# Altium schematic sheet ifamp-tx.SchDoc: TX IF Amplifier
size Letter; CheckedBy: J. Brinton; CompanyName: Signal Laboratories, Inc.; DrawnBy: J. Brinton; Engineer: J. Brinton; Address1: 3479 Edison Way; Address2: Menlo Park CA 94025; Address3: +1 (877) 778-8435; Address4: siglabs.com; Revision: 3; SheetNumber: 5; SheetTotal: 49
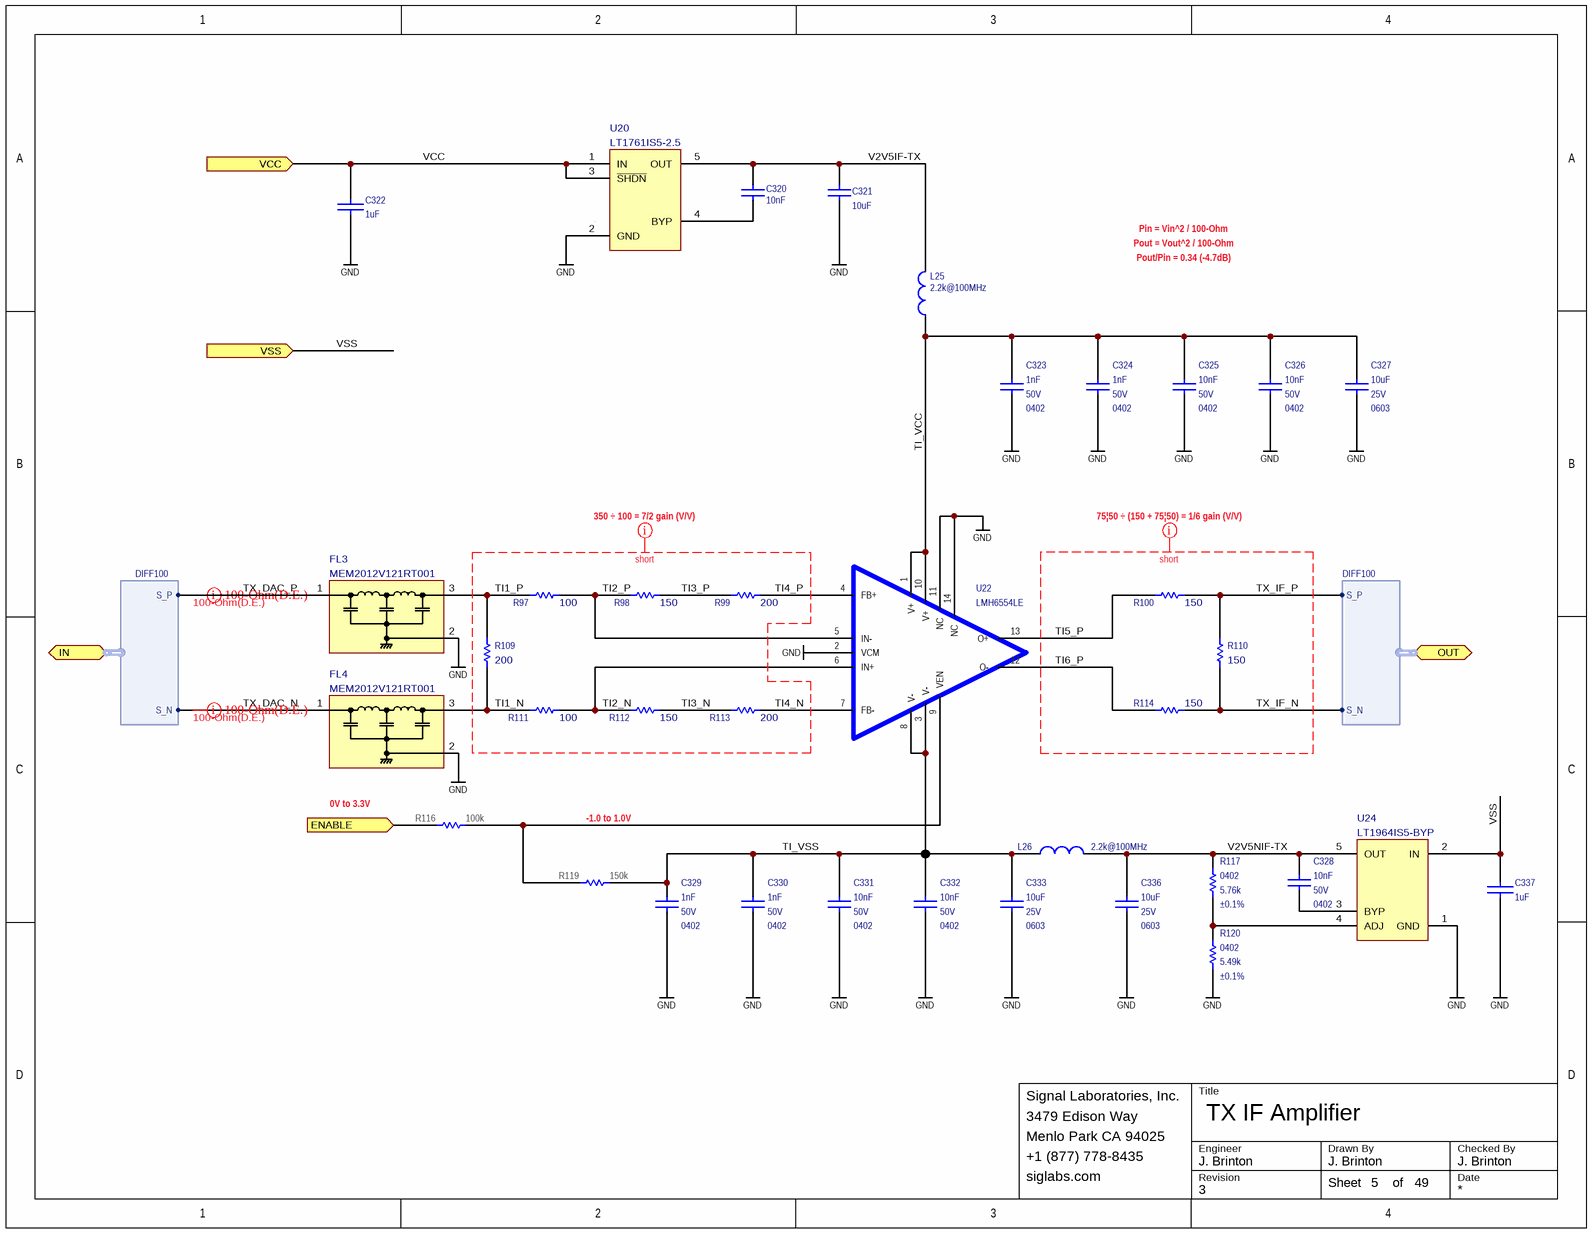
[diagram p0: ifamp-tx.SchDoc]

## Parts
C320  value 10nF  [CAPC100X50X55L25N]  (hidden comment: GRM155R71H103KA88)
C321  value 10uF  [CAPC160X80X90L20N]  (hidden comment: ZRB18AR61E106ME01L)
C322  value 1uF  [CAPC100X50X55L25N]  (hidden comment: GRM155R61A105KE15)
C323  value 1nF  Voltage: 50V  Package: 0402  [CAPC100X50X55L25N]  (hidden comment: CGA2B2NP01H102J050BA)
C324  value 1nF  Voltage: 50V  Package: 0402  [CAPC100X50X55L25N]  (hidden comment: CGA2B2NP01H102J050BA)
C325  value 10nF  Voltage: 50V  Package: 0402  [CAPC100X50X55L25N]  (hidden comment: GRM155R71H103KA88)
C326  value 10nF  Voltage: 50V  Package: 0402  [CAPC100X50X55L25N]  (hidden comment: GRM155R71H103KA88)
C327  value 10uF  Voltage: 25V  Package: 0603  [CAPC160X80X90L20N]  (hidden comment: ZRB18AR61E106ME01L)
C328  value 10nF  Voltage: 50V  Package: 0402  [CAPC100X50X55L25N]  (hidden comment: GRM155R71H103KA88)
C329  value 1nF  Voltage: 50V  Package: 0402  [CAPC100X50X55L25N]  (hidden comment: CGA2B2NP01H102J050BA)
C330  value 1nF  Voltage: 50V  Package: 0402  [CAPC100X50X55L25N]  (hidden comment: CGA2B2NP01H102J050BA)
C331  value 10nF  Voltage: 50V  Package: 0402  [CAPC100X50X55L25N]  (hidden comment: GRM155R71H103KA88)
C332  value 10nF  Voltage: 50V  Package: 0402  [CAPC100X50X55L25N]  (hidden comment: GRM155R71H103KA88)
C333  value 10uF  Voltage: 25V  Package: 0603  [CAPC160X80X90L20N]  (hidden comment: ZRB18AR61E106ME01L)
C336  value 10uF  Voltage: 25V  Package: 0603  [CAPC160X80X90L20N]  (hidden comment: ZRB18AR61E106ME01L)
C337  value 1uF  [CAPC100X50X55L25N]  (hidden comment: GRM155R61A105KE15)
FL3  MEM2012V121RT001  [MEM2012V]
FL4  MEM2012V121RT001  [MEM2012V]
L25  value 2.2k@100MHz  [INDC1005X55N]  (hidden comment: MMZ1005A222ET000)
L26  value 2.2k@100MHz  [INDC1005X55N]  (hidden comment: MMZ1005A222ET000)
R97  value 100  [RESC1608X55N]  (hidden comment: MCT0603MD1000DP500)
R98  value 150  [RESC1608X55N]  (hidden comment: MCT0603MD1500DP500)
R99  value 200  [RESC1608X55N]  (hidden comment: MCT06030C2000FP500)
R100  value 150  [RESC1608X55N]  (hidden comment: MCT0603MD1500DP500)
R109  value 200  [RESC1608X55N]  (hidden comment: MCT06030C2000FP500)
R110  value 150  [RESC1608X55N]  (hidden comment: MCT0603MD1500DP500)
R111  value 100  [RESC1608X55N]  (hidden comment: MCT0603MD1000DP500)
R112  value 150  [RESC1608X55N]  (hidden comment: MCT0603MD1500DP500)
R113  value 200  [RESC1608X55N]  (hidden comment: MCT06030C2000FP500)
R114  value 150  [RESC1608X55N]  (hidden comment: MCT0603MD1500DP500)
R116  value 100k  [RESC1005X40N]  (hidden comment: ERJ-2RKF1003X)
R117  value 5.76k  Tolerance: ±0.1%  Package: 0402  [RESC1005X40N]  (hidden comment: RT0402BRE075K76L)
R119  value 150k  [RESC1005X40N]  (hidden comment: ERJ-2RKF1503X)
R120  value 5.49k  Tolerance: ±0.1%  Package: 0402  [RESC1005X40N]  (hidden comment: ERA-2AEB5491X)
U20  LT1761IS5-2.5  [TSOT-5]
U22  LMH6554LE  [NHJ0014A]
U24  LT1964IS5-BYP  [SOT23-5]

## Ports
ENABLE (in), IN (harness DIFF100), OUT (harness DIFF100), VCC (in), VSS (in)

## Harnesses
DIFF100: S_P, S_N

## Nets
GND: C321.1 C322.1 C323.1 C324.1 C325.1 C326.1 C327.1 C329.1 C330.1 C331.1 C332.1 C333.1 C336.1 C337.1 FL3.2(GND) FL4.2(GND) R120.1 U20.2(GND) U22.2(VCM) U22.11(NC) U22.14(NC) U24.1(GND)
ENABLE: R116.2 ; port ENABLE
TI1_N: FL4.3(OUT/IN) R109.1 R111.1
TI1_P: FL3.3(OUT/IN) R97.1 R109.2
TI2_N: R111.2 R112.1 U22.6(IN+)
TI2_P: R97.2 R98.1 U22.5(IN-)
TI3_N: R112.2 R113.1
TI3_P: R98.2 R99.1
TI4_N: R113.2 U22.7(FB-)
TI4_P: R99.2 U22.4(FB+)
TI5_P: R100.1 U22.13(O+)
TI6_P: R114.1 U22.12(O-)
TI_VCC: C323.2 C324.2 C325.2 C326.2 C327.2 L25.1 U22.1(V+) U22.10(V+)
TI_VSS: C329.2 C330.2 C331.2 C332.2 C333.2 L26.1 R119.1 U22.3(V-) U22.8(V-)
TX_DAC_N: FL4.1(IN/OUT) ; port IN.S_N
TX_DAC_P: FL3.1(IN/OUT) ; port IN.S_P
TX_IF_N: R110.1 R114.2 ; port OUT.S_N
TX_IF_P: R100.2 R110.2 ; port OUT.S_P
V2V5IF-TX: C320.2 C321.2 L25.2 U20.5(OUT)
V2V5NIF-TX: C328.2 C336.2 L26.2 R117.2 U24.5(OUT)
VCC: C322.2 U20.1(IN) U20.3(~{SHDN}) ; port VCC
VSS: C337.2 U24.2(IN) ; port VSS
NetC320_1: C320.1 U20.4(BYP)
NetC328_1: C328.1 U24.3(BYP)
NetR116_1: R116.1 R119.2 U22.9(VEN)
NetR117_1: R117.1 R120.2 U24.4(ADJ)

## Layout directives
differential pair; net class z100diff12; Name: 100-Ohm(D.E.); net class rf: TX_DAC_N, TX_DAC_P
net class short: TI1_N, TI1_P, TI2_N, TI2_P, TI3_N, TI3_P, TI4_N, TI4_P, TI5_P, TI6_P, TX_IF_N, TX_IF_P

## Notes on the sheet
- Pin = Vin^2 / 100-Ohm
- Pout = Vout^2 / 100-Ohm
- Pout/Pin = 0.34 (-4.7dB)
- 350 ÷ 100 = 7/2 gain (V/V)
- 75|50 ÷ (150 + 75|50) = 1/6 gain (V/V)
- 0V to 3.3V
- -1.0 to 1.0V
- Title
- Engineer
- Revision
- Drawn By
- Checked By
- Date
- Sheet
- of

## Library data of the parts
C320 C325 C326 C328 C331 C332 = CAP 0402: Ceramic Capacitor 10nF ±10% 50V X7R 0402; Manufacturer: Murata; Tr: -55:125; Manufacturer P/N: GRM155R71H103KA88; Tolerance: ±10%
  C320: Voltage: 50V; Package: 0402
C321 C327 C333 C336 = CAP 0603: Ceramic Capacitor 10uF ±20% 25V X5R 0603; Manufacturer: Murata; Tr: -55:85; Manufacturer P/N: ZRB18AR61E106ME01L; Tolerance: ±20%
  C321: Voltage: 25V; Package: 0603
C322 C337 = CAP: Ceramic Capacitor 1uF ±10% 10V X5R 0402; Manufacturer: Murata; Tr: -55:125; Manufacturer P/N: GRM155R61A105KE15; Package: 0402; Tolerance: ±10%; Voltage: 10V
C323 C324 C329 C330 = CAP 0402: Ceramic Capacitor 1nF ±5% 50V NP0 0402; Manufacturer: TDK; Tr: -55:150; Manufacturer P/N: CGA2B2NP01H102J050BA; Tolerance: ±5%
FL3 FL4 = MEM2012V121RT001: MEM2012 Series 120 MHz 10V 100mA SMT Signal Line 3-Terminal Filter; Manufacturer: TDK; Package: MEM2012V; Manufacturer P/N: MEM2012V121RT001
L25 L26 = INDUCTANCE1: Ferrite Bead 2.2k@100MHz 150mA 0402; Manufacturer: TDK; Tr: -55:125; Manufacturer P/N: MMZ1005A222ET000; Package: 0402
R97 R111 = RES 0603: Thin Film Resistor 100 Ohm ±0.5% 0603; Manufacturer: Vishay; Tr: -55:175; Package: 0603; Manufacturer P/N: MCT0603MD1000DP500; Do Not Place: *; Tolerance: ±0.5%
R98 R100 R110 R112 R114 = RES 0603: Thin Film Resistor 150 Ohm ±0.5% 0603; Manufacturer: Vishay; Tr: -55:155; Package: 0603; Manufacturer P/N: MCT0603MD1500DP500; Do Not Place: *; Tolerance: ±0.5%
R99 R109 R113 = RES 0603: Thin Film Resistor 200 Ohm ±1% 0603; Manufacturer: Vishay; Tr: -55:155; Package: 0603; Manufacturer P/N: MCT06030C2000FP500; Do Not Place: *; Tolerance: ±1%
R116 = RES: Thick Film Resistor 100k ±1% 0.1W 50V 0402; Manufacturer: Panasonic; Tcr: ±100; Tr: -55:155; Voltage: 50; Power: 0.1; Manufacturer P/N: ERJ-2RKF1003X; Tolerance: ±1%; Alternatives: *; Footprint: *; Package: 0402
R117 = RES: Thin Film Resistor 5.76k +/-0.1% SMD 0402; Manufacturer: Yageo; Tr: -55:155; Tcr: *; Manufacturer P/N: RT0402BRE075K76L; Alternatives: *; Voltage: *; Power: *
R119 = RES: Thick Film Resistor 150k ±1% 0.1W 50V 0402; Manufacturer: Panasonic; Tcr: ±100; Tr: -55:155; Voltage: 50; Power: 0.1; Manufacturer P/N: ERJ-2RKF1503X; Tolerance: ±1%; Alternatives: *; Footprint: *; Package: 0402
R120 = RES: Thin Film Resistor 5.49k +/-0.1% SMD 0402; Manufacturer: Panasonic; Tr: -55:155; Tcr: *; Manufacturer P/N: ERA-2AEB5491X; Alternatives: *; Voltage: *; Power: *
U20 = LT1761IS5-5: 100mA Low Noise LDO 5V; Manufacturer: Linear Technology; Manufacturer P/N: LT1761IS5-5
U22 = LMH6554LE: 2.8 GHz Ultra Linear Fully Differential Amplifier; Manufacturer: Texas Instruments; Manufacturer P/N: LMH6554LE
U24 = LT1964IS5-BYP: 200mA Low Noise negative-LDO; Manufacturer: Linear Technology; Manufacturer P/N: LT1964IS5-BYP